# Altium schematic sheet Gas_Sampler-Top.SchDoc: Top
size Tabloid; Organization: Sensible Robotics LLC; Address1: 120 E Church Ave Suite B; Address2: Ridgecrest CA, 93555; Revision: 0; SheetNumber: 1; SheetTotal: 12; ApprovedBy: Approved Name; Engineer: Mike Licitra; PageSetup: Record=PageOptions|CenterHorizontal=True|CenterVertical=True|PrintScale=0.98|XCorrection=1.00|YCorrection=1.00|PrintKind=0|BorderSize=5000000|LeftOffset=0|BottomOffset=0|Orientation=2|PaperLength=1000|PaperWidth=1000|Scale=100|PaperSource=15|PrintQuality=600|MediaType=1|DitherType=10|PaperKind=Tabloid|PrintScaleMode=1
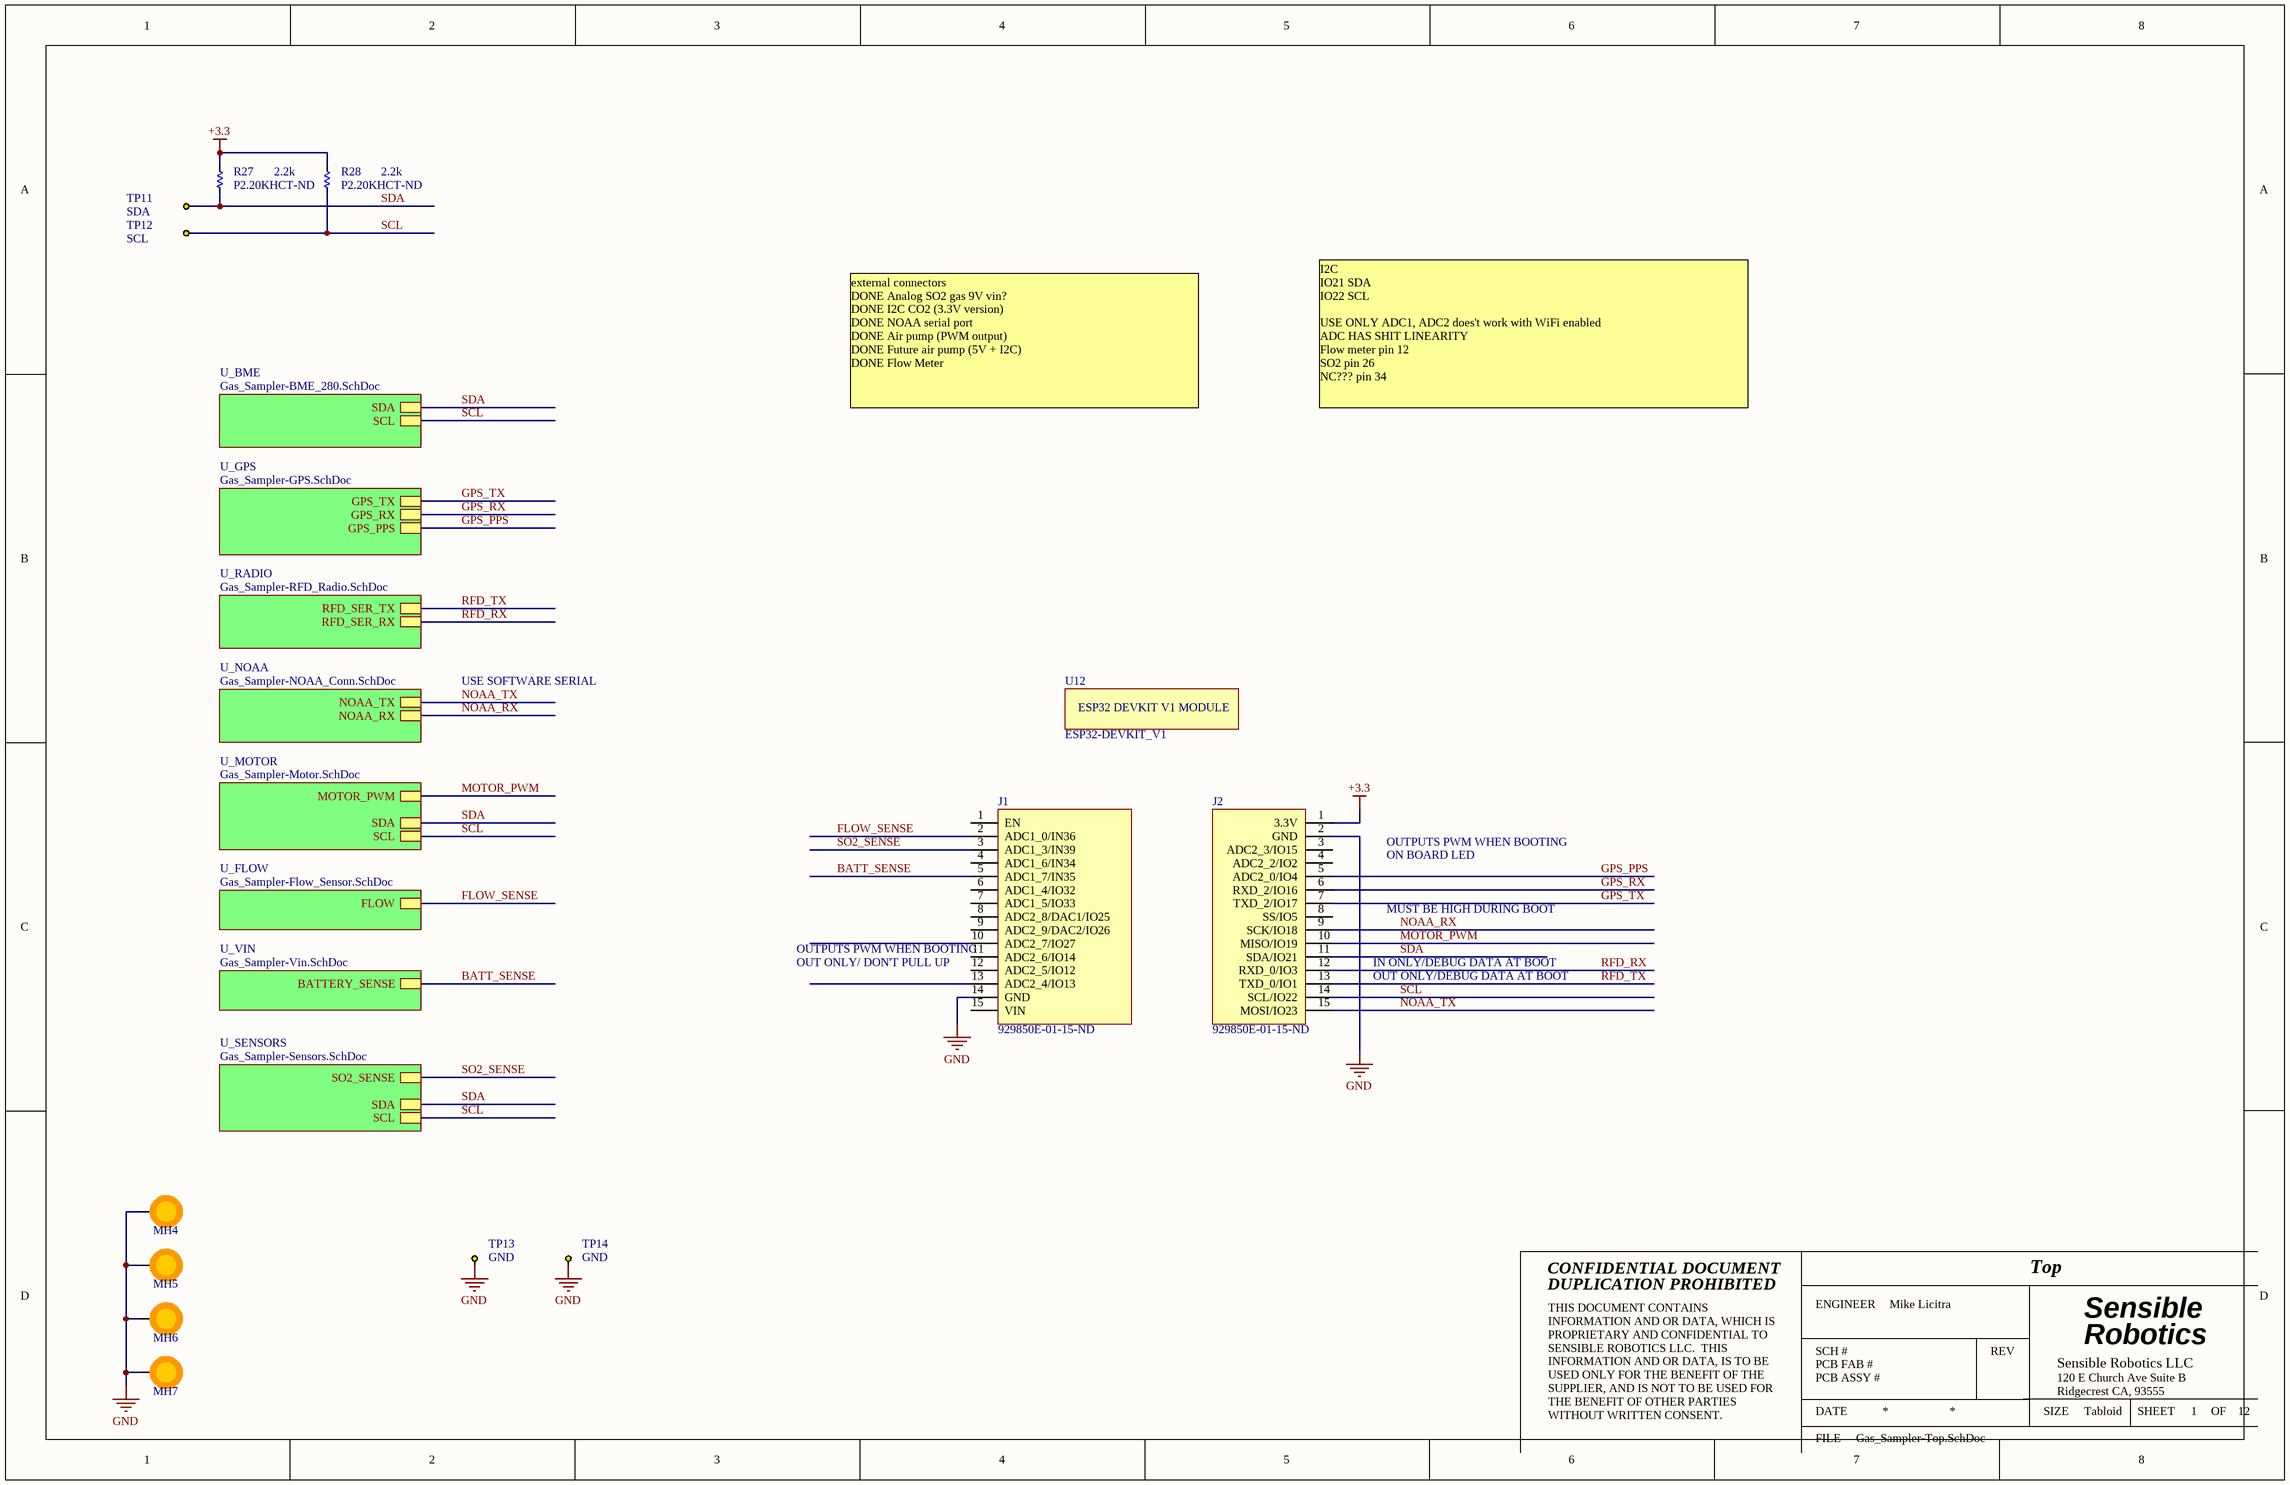
[diagram p0: Gas_Sampler-Top.SchDoc]

## Parts
J1  Supplier Part Number 1: 929850E-01-15-ND  [SOCKET_1X15_POS_0.1_INCH]  (hidden comment: ESP32-DEVKIT_V1-30PIN_MODULE_J2)
J2  Supplier Part Number 1: 929850E-01-15-ND  [SOCKET_1X15_POS_0.1_INCH]  (hidden comment: ESP32-DEVKIT_V1-30PIN_MODULE_J3)
MH4  SCREW  [SCREW_M3]  (value not drawn)  (no BOM)
MH5  SCREW  [SCREW_M3]  (value not drawn)  (no BOM)
MH6  SCREW  [SCREW_M3]  (value not drawn)  (no BOM)
MH7  SCREW  [SCREW_M3]  (value not drawn)  (no BOM)
R27  value 2.2k  Supplier Part Number 1: P2.20KHCT-ND  [R0603]  (hidden comment: RES_0603_2.2K_OHM_1/10W_1%)
R28  value 2.2k  Supplier Part Number 1: P2.20KHCT-ND  [R0603]  (hidden comment: RES_0603_2.2K_OHM_1/10W_1%)
TP11  SDA  [TP_KEYSTONE_5001]
TP12  SCL  [TP_KEYSTONE_5001]
TP13  GND  [TP_KEYSTONE_5001]
TP14  GND  [TP_KEYSTONE_5001]
U12  ESP32-DEVKIT_V1  [ESP32_DEVKITV1_MODULE]

## Sub-sheets
U_BME = Gas_Sampler-BME_280.SchDoc: SDA, SCL
U_FLOW = Gas_Sampler-Flow_Sensor.SchDoc: FLOW
U_GPS = Gas_Sampler-GPS.SchDoc: GPS_PPS, GPS_TX, GPS_RX
U_MOTOR = Gas_Sampler-Motor.SchDoc: MOTOR_PWM, SDA, SCL
U_NOAA = Gas_Sampler-NOAA_Conn.SchDoc: NOAA_RX, NOAA_TX
U_RADIO = Gas_Sampler-RFD_Radio.SchDoc: RFD_SER_TX, RFD_SER_RX
U_SENSORS = Gas_Sampler-Sensors.SchDoc: SDA, SCL, SO2_SENSE
U_VIN = Gas_Sampler-Vin.SchDoc: BATTERY_SENSE

## Nets
+3.3: J2.1(3.3V) R27.2 R28.2
GND: J1.14(GND) J2.2(GND) MH4.1 MH5.1 MH6.1 MH7.1 TP13.1 TP14.1
BATT_SENSE: J1.5(ADC1_7/IN35) ; sheet U_VIN/BATTERY_SENSE
FLOW_SENSE: J1.2(ADC1_0/IN36) ; sheet U_FLOW/FLOW
GPS_PPS: J2.5(ADC2_0/IO4) ; sheet U_GPS/GPS_PPS
GPS_RX: J2.6(RXD_2/IO16) ; sheet U_GPS/GPS_RX
GPS_TX: J2.7(TXD_2/IO17) ; sheet U_GPS/GPS_TX
MOTOR_PWM: J2.10(MISO/IO19) ; sheet U_MOTOR/MOTOR_PWM
NOAA_RX: J2.9(SCK/IO18) ; sheet U_NOAA/NOAA_RX
NOAA_TX: J2.15(MOSI/IO23) ; sheet U_NOAA/NOAA_TX
RFD_RX: J2.12(RXD_0/IO3) ; sheet U_RADIO/RFD_SER_RX
RFD_TX: J2.13(TXD_0/IO1) ; sheet U_RADIO/RFD_SER_TX
SCL: J2.14(SCL/IO22) R28.1 TP12.1 ; sheet U_BME/SCL, sheet U_MOTOR/SCL, sheet U_SENSORS/SCL
SDA: J2.11(SDA/IO21) R27.1 TP11.1 ; sheet U_BME/SDA, sheet U_MOTOR/SDA, sheet U_SENSORS/SDA
SO2_SENSE: J1.3(ADC1_3/IN39) ; sheet U_SENSORS/SO2_SENSE

Not connected (* = marked no-connect by the designer): J1 1(EN) 4(ADC1_6/IN34) 6(ADC1_4/IO32) 7(ADC1_5/IO33) 8(ADC2_8/DAC1/IO25) 9(ADC2_9/DAC2/IO26) 10(ADC2_7/IO27) 11(ADC2_6/IO14) 12(ADC2_5/IO12) 13(ADC2_4/IO13) 15(VIN); J2 3(ADC2_3/IO15) 4(ADC2_2/IO2) 8(SS/IO5)

## Notes on the sheet
- external connectors
  DONE Analog SO2 gas 9V vin?
  DONE I2C CO2 (3.3V version)
  DONE NOAA serial port
  DONE Air pump (PWM output)
  DONE Future air pump (5V + I2C)
  DONE Flow Meter
- I2C
  IO21 SDA
  IO22 SCL
  USE ONLY ADC1, ADC2 does't work with WiFi enabled
  ADC HAS SHIT LINEARITY
  Flow meter pin 12
  SO2 pin 26
  NC??? pin 34
- USE SOFTWARE SERIAL
- ON BOARD LED
- OUTPUTS PWM WHEN BOOTING
- OUT ONLY/ DON'T PULL UP
- IN ONLY/DEBUG DATA AT BOOT
- MUST BE HIGH DURING BOOT
- OUT ONLY/DEBUG DATA AT BOOT
- CONFIDENTIAL DOCUMENT
- DUPLICATION PROHIBITED
- ENGINEER
- PCB FAB #
- SCH #
- REV
- Sensible
- Robotics
- THIS DOCUMENT CONTAINS INFORMATION AND OR DATA, WHICH IS PROPRIETARY AND CONFIDENTIAL TO SENSIBLE ROBOTICS LLC.  THIS INFORMATION AND OR DATA, IS TO BE USED ONLY FOR THE BENEFIT OF THE SUPPLIER, AND IS NOT TO BE USED FOR THE BENEFIT OF OTHER PARTIES WITHOUT WRITTEN CONSENT.
- DATE
- PCB ASSY #
- SIZE
- Tabloid
- SHEET
- OF
- FILE
- (in symbol ESP32-DEVKIT_V1) ESP32 DEVKIT V1 MODULE

## Library data of the parts
J1 = ESP32-DEVKIT_V1-30PIN_MODULE_J2: CONN_SOCKETS_1X15_POS_0.1_INCH; Manufacturer: 3M; Manufacturer Part Number: 929850-01-15-RA; Connector Type: Receptacle; Number of Positions: 19; Number of Positions Loaded: All; Pitch: 0.100" (2.54mm); Supplier 1: Digi-Key; Packaging: Bulk; Contact Type: Forked; Number of Rows: 1; Mounting Type: Through Hole; Termination: Solder; Contact Finish: Gold; Contact Finish Thickness: 10µin (0.25µm); ComponentLink1URL: http://multimedia.3m.com/mws/mediawebserver?66666UuZjcFSLXTt4Xf_LXs6EVuQEcuZgVs6EVs6E666666--; ComponentLink1Description: http://multimedia.3m.com/mws/mediawebserver?66666UuZjcFSLXTt4Xf_LXs6EVuQEcuZgVs6EVs6E666666--
J2 = ESP32-DEVKIT_V1-30PIN_MODULE_J3: CONN_SOCKETS_1X15_POS_0.1_INCH; Manufacturer: 3M; Manufacturer Part Number: 929850-01-15-RA; Connector Type: Receptacle; Number of Positions: 19; Number of Positions Loaded: All; Pitch: 0.100" (2.54mm); Supplier 1: Digi-Key; Packaging: Bulk; Contact Type: Forked; Number of Rows: 1; Mounting Type: Through Hole; Termination: Solder; Contact Finish: Gold; Contact Finish Thickness: 10µin (0.25µm); ComponentLink1URL: http://multimedia.3m.com/mws/mediawebserver?66666UuZjcFSLXTt4Xf_LXs6EVuQEcuZgVs6EVs6E666666--; ComponentLink1Description: http://multimedia.3m.com/mws/mediawebserver?66666UuZjcFSLXTt4Xf_LXs6EVuQEcuZgVs6EVs6E666666--
R27 R28 = RES_0603_2.2K_OHM_1/10W_1%: RES 2.2K OHM 1/10W 1% 0603 SMD; Manufacturer: Panasonic Electronic Components; Manufacturer Part Number: ERJ-3EKF2201V; Part Number: 470-00097-00; Power (Watts): 0.1W, 1/10W; Temperature Coefficient: ±100ppm/°C; Supplier 1: Digi-Key; RoHS: RoHS Compliant; Category: Resistors; Stock 1: 242061; Pricing 1: 1=0.1, 50=0.0138, 100=0.0105, 250=0.0078, 500=0.00576, 1000=0.00384 (USD); Packaging: Cut Tape (CT); Composition: Thick Film; Features: -; Tolerance: ±1%; Package / Case: 0603 (1608 Metric); Supplier Device Package: 0603; Size / Dimension: 0.063" L x 0.031" W (1.60mm x 0.80mm); Height: 0.022" (0.55mm); Number of Terminations: 2; ComponentLink1URL: http://industrial.panasonic.com/www-cgi/jvcr13pz.cgi?E+PZ+3+AOA0002+ERJ3EKF2201V+7+WW; ComponentLink1Description: http://industrial.panasonic.com/www-cgi/jvcr13pz.cgi?E+PZ+3+AOA0002+ERJ3EKF2201V+7+WW
TP11-TP14 = TEST_KEYSTONE5001: PC TEST POINT TH RING; Manufacturer: Keystone Electronics; Manufacturer Part Number: 5001; Part Number: 250-00184-00; Supplier 1: Digi-Key; Supplier Part Number 1: 5001K-ND; RoHS: RoHS Compliant; Category: Test and Measurement; Stock 1: 341830; Pricing 1: 1=0.33, 10=0.309, 50=0.2252, 100=0.2164, 250=0.19432, 500=0.18548, 1000=0.15456, 2500=0.14131, 5000=0.13248 (USD); Packaging: Bulk; Type: PC Test Point, Miniature; Terminal: 0.010" x 0.020" (0.25mm x 0.51mm) Phosphor Bronze Wire, Silver Plate; Mounting Type: 0.040" (1.02mm) Hole Diameter; Material: Base, Nylon 46, UL 94V-0; Color: Black; ComponentLink1URL: http://www.keyelco.com/product-pdf.cfm?p=1310; ComponentLink1Description: http://www.keyelco.com/product-pdf.cfm?p=1310
U12 = ESP32-DEVKIT_V1: ESP32-DEVKIT V1 MODULE; Supplier 1: Digi-Key